# EasyEDA schematic SCH_Flipper-FN.json
TITLE: Flipper to FN board; REV: 1.1; Date: 2023-04-22; Sheet: 1/1; Company: OpenSorce
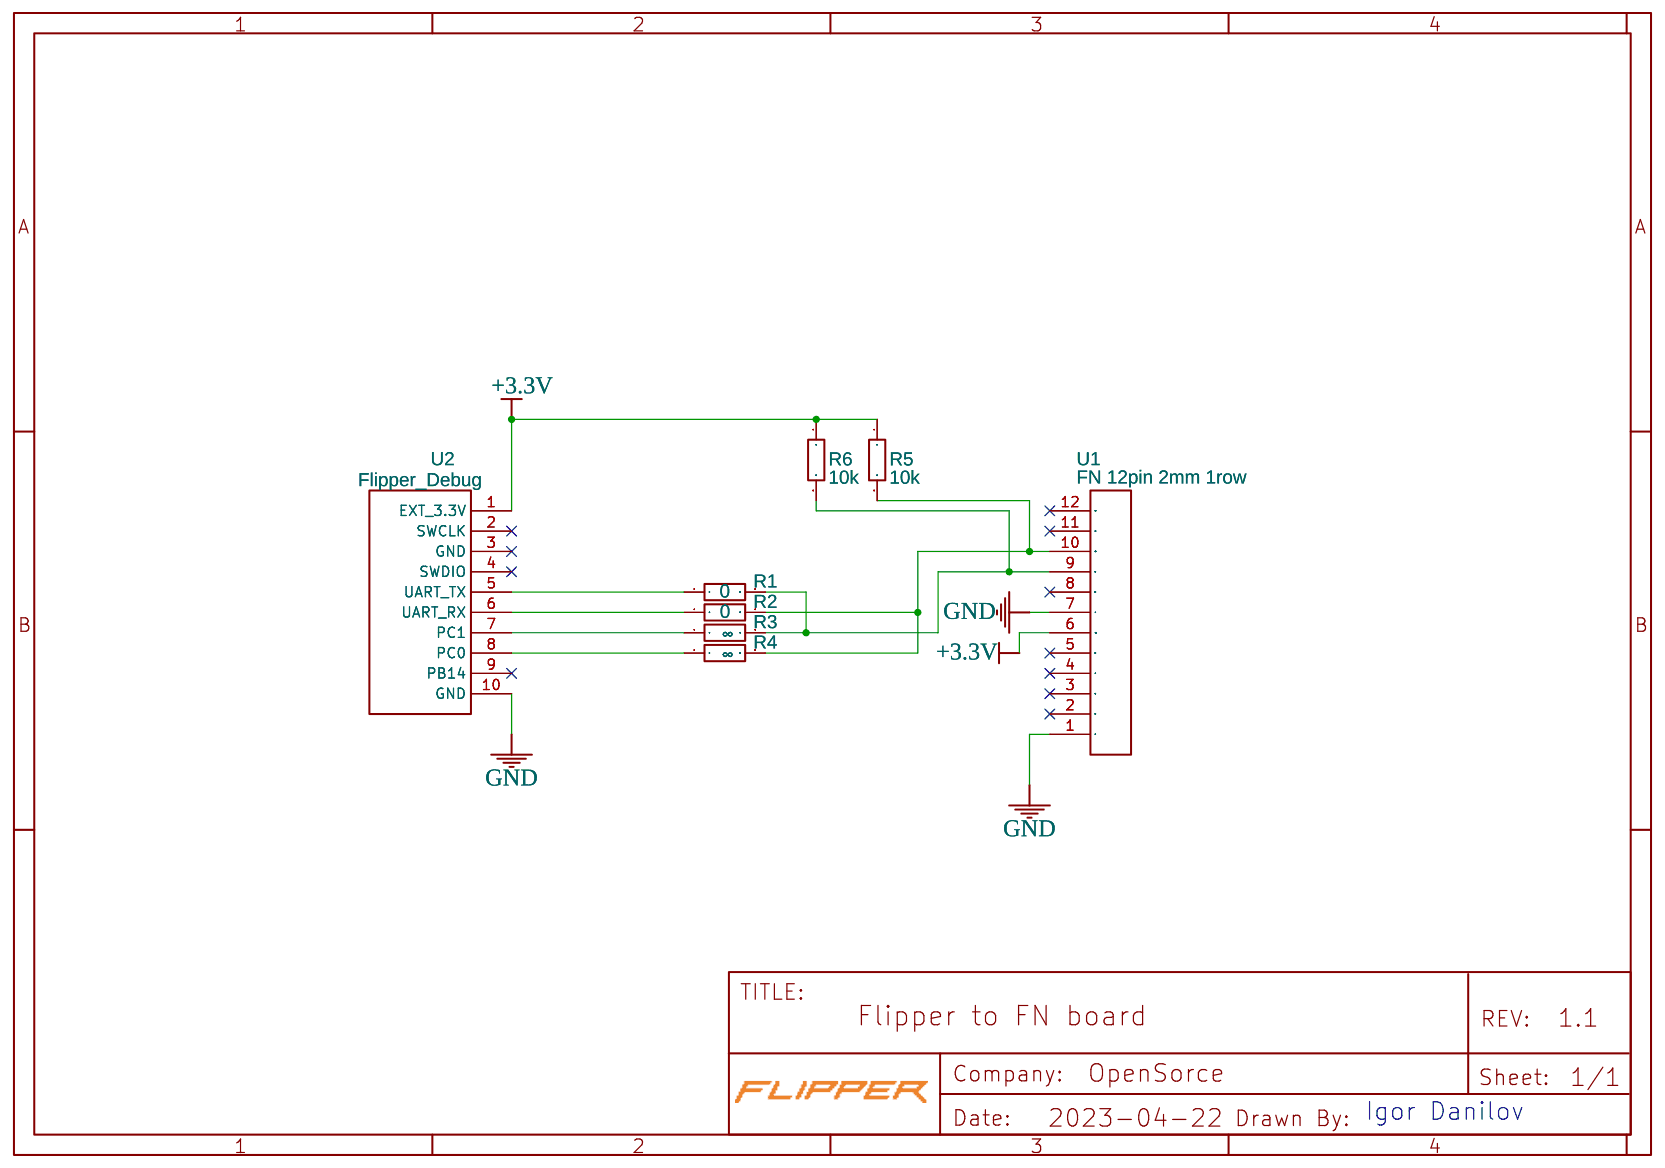
[diagram p0: schematic sheet]

## Parts
R1  0  [0805]
R2  0  [0805]
R3  ∞  [0805]
R4  ∞  [0805]
R5  10k  [0805]
R6  10k  [0805]
U1  FN 12pin 2mm 1row  [PIN HEADER 12PIN 2MM 1ROW]
U2  Flipper_Debug  [HDR1X10]

## Library data of the parts
R1-R6 = SMD_Resistor: Supplier Part: C72672; Supplier: LCSC; Manufacturer: Shiheng; Manufacturer Part: CMFB103F3970; Contributor: Олександр Загородній
U1 = 12pin 2mm 1row: Contributor: pigboard
U2 = Flipper_Debug: Contributor: skotopes

## Nets
+3.3V: R5.1 R6.1 U1.6(+3.3V) U2.1(EXT_3.3V)
GND: U1.1 U1.7 U2.10(GND)
Net-(R1-1): R1.1 U2.5(UART_TX)
Net-(R1-2): R1.2 R3.2 R6.2 U1.9
Net-(R2-1): R2.1 U2.6(UART_RX)
Net-(R2-2): R2.2 R4.2 R5.2 U1.10
Net-(R3-1): R3.1 U2.7(PC1)
Net-(R4-1): R4.1 U2.8(PC0)

Not connected (* = marked no-connect by the designer): U1 2* 3* 4* 5* 8* 11* 12*; U2 2(SWCLK)* 3(GND)* 4(SWDIO)* 9(PB14)*

## Notes on the sheet
- Igor Danilov
